# Altium schematic sheet oiler_sch.SchDoc
size A4
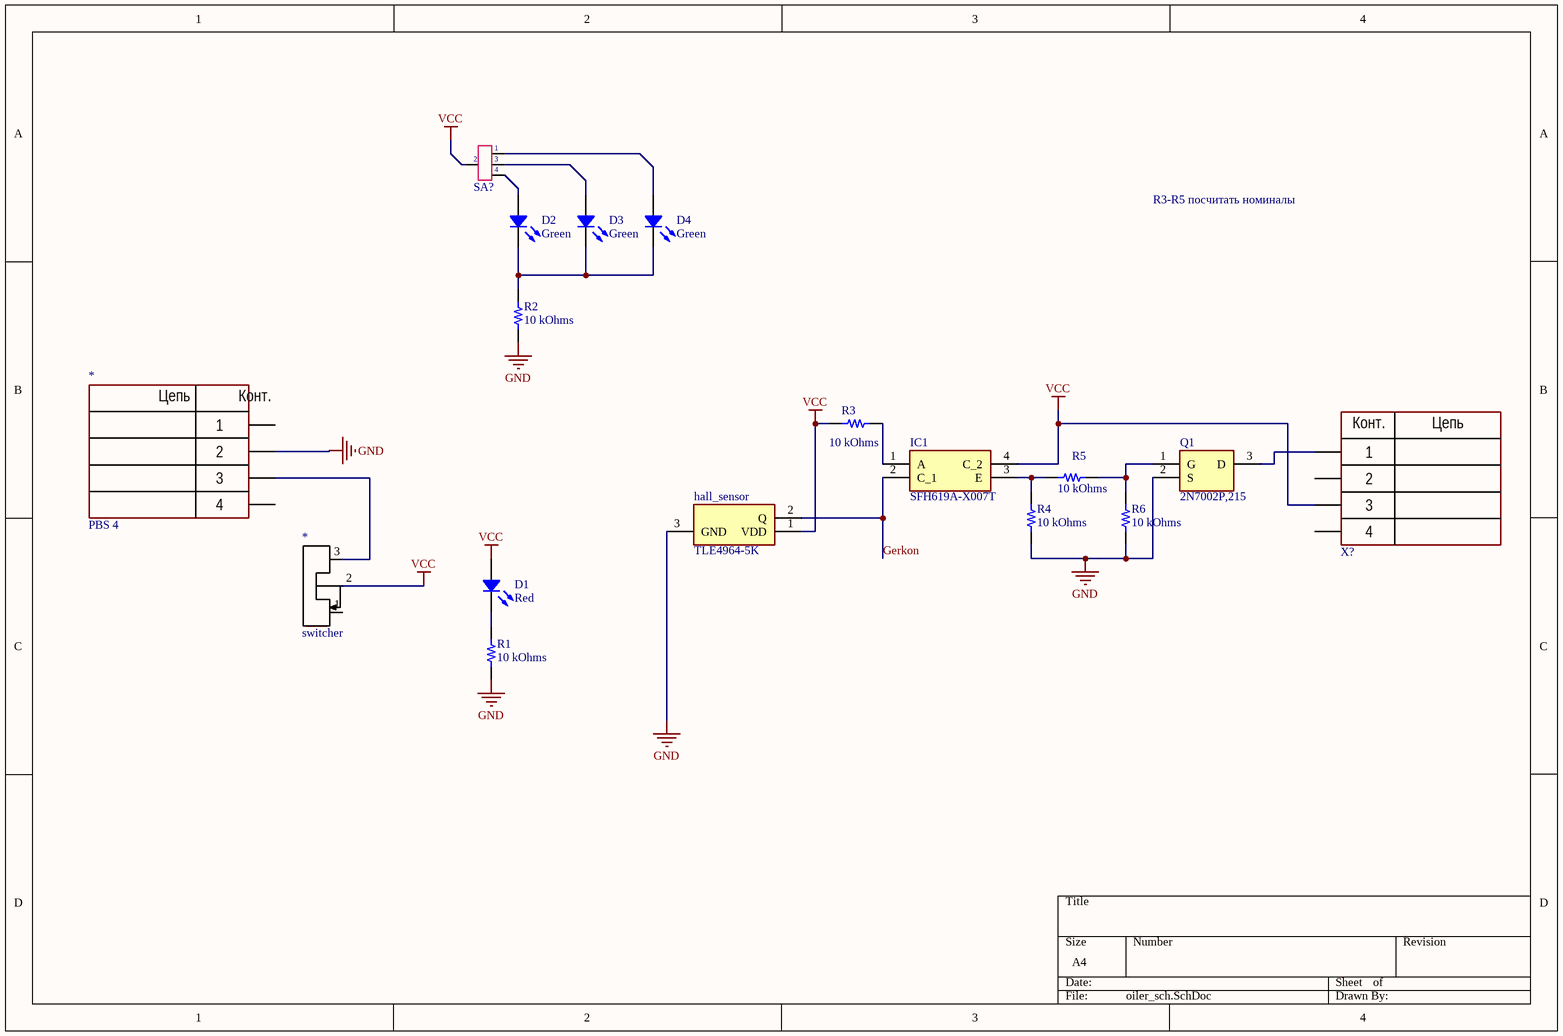
[diagram p0: oiler_sch.SchDoc]

## Parts
(Parts that share a designator on the sheet are numbered #1, #2 ... from top to bottom, then left to right.)
*#1  PBS 4  [PBS-4 CUT]
*#2  switcher  [switcher]
D1  Red  [LED 1206_3216 RED]
D2  Green  [LED 0603_1608 GREEN]
D3  Green  [LED 0603_1608 GREEN]
D4  Green  [LED 0603_1608 GREEN]
hall_sensor  TLE4964-5K  [SOT95P285X120-3N]
IC1  SFH619A-X007T  [SOP252P1016X430-4N]
Q1  2N7002P,215  [SOT95P230X110-3N]
R1  10 kOhms  [RES 0603_1608]
R2  10 kOhms  [RES 0603_1608]
R3  10 kOhms  [RES 0603_1608]
R4  10 kOhms  [RES 0603_1608]
R5  10 kOhms  [RES 0603_1608]
R6  10 kOhms  [RES 0603_1608]
SA?  Switcher  [SMD]  (value not drawn)
X?  PLS 4  [pls-4 right angle]  (value not drawn)

## Nets
GND: *#1.2 hall_sensor.3(GND) Q1.2(S) R1.1 R2.1 R4.2 R6.1
VCC: *#2.2 D1.1 hall_sensor.1(VDD) IC1.4(C_2) R3.2 SA?.2 X?.3
Gerkon: hall_sensor.2(Q) IC1.2(C_1)
Net*#1_3: *#1.3 *#2.3
NetD1_2: D1.2 R1.2
NetD2_1: D2.1 SA?.4
NetD2_2: D2.2 D3.2 D4.2 R2.2
NetD3_1: D3.1 SA?.3
NetD4_1: D4.1 SA?.1
NetIC1_1: IC1.1(A) R3.1
NetIC1_3: IC1.3(E) R4.1 R5.1
NetQ1_1: Q1.1(G) R5.2 R6.2
NetQ1_3: Q1.3(D) X?.1

Not connected (* = marked no-connect by the designer): *#1 1 4; *#2 1; X? 2 4

## Notes on the sheet
- R3-R5 посчитать номиналы
- (in symbol PBS 4) Цепь; Конт.
- (in symbol PLS 4) Конт.; Цепь

## Library data of the parts
D1 = SML-LX1206SIC-TR: LED RED CLEAR 1206 SMD; Manufacturer: Lumex Opto/Components Inc.; Configuration: Standard; Current - Test: 20mA; Lens Color: Colorless; Lens Size: 2.00mm x 1.50mm; Lens Style: Rectangle with Flat Top; Millicandela Rating: 54mcd; Viewing Angle: 130°; Voltage - Forward (Vf) (Typ): 2V; Wavelength - Peak: 632nm; Part Number: SML-LX1206SIC-TR; Color: Red; ComponentLink1Description: Datasheet; ComponentLink1URL: https://www.lumex.com/content/files/ProductAttachment/SML-LX1206SIC-TR.pdf; ComponentLink2Description: DigiKey Link; ComponentLink2URL: http://digikey.com/product-detail/en/lumex-opto-components-inc/SML-LX1206SIC-TR/67-1695-1-ND/467580; Device Package: 1206 (3216 Metric); Height (Max): 1.10mm; LastUpdated: 21.01.2020 3:14:28; Lens Transparency: Clear; Lifecycle Status: Active; Minimum Order: 1; Mounting Type: Surface Mount; Package / Case: 1206 (3216 Metric); Packaging: TapeAndReel; PartId: 205; Part Status: Active; Price: 0.11; Series: -; Size / Dimension: 3.20mm L x 1.60mm W; Supplier 1: DigiKey; Supplier Part Number 1: 67-1695-1-ND; Supplier Device Package: 1206; Value: Red
D2-D4 = LSM0603453V: LED SM 0603 3V -/1000/-MCD GREEN; Manufacturer: Visual Communications Company - VCC; Configuration: Standard; Current - Test: 20mA; Lens Color: Colorless; Lens Size: 1.20mm x 0.80mm; Lens Style: Rectangle with Flat Top; Lens Transparency: Clear; Millicandela Rating: 63mcd; Viewing Angle: 120°; Voltage - Forward (Vf) (Typ): 2V; Wavelength - Dominant: 572nm; Wavelength - Peak: 571nm; Part Number: LSM0603453V; Color: Green; ComponentLink1Description: Datasheet; ComponentLink1URL: https://vcclite.com/wp-content/uploads/wpallimport/files/files/LSM0603453V.pdf; ComponentLink2Description: DigiKey Link; ComponentLink2URL: http://digikey.com/product-detail/en/visual-communications-company-vcc/LSM0603453V/LSM0603453VCT-ND/9486729; Device Package: 0603 (1608 Metric); Height (Max): 0.65mm; LastUpdated: 21.01.2020 3:12:15; Lifecycle Status: Active; Minimum Order: 1; Mounting Type: Surface Mount; Package / Case: 0603 (1608 Metric); Packaging: TapeAndReel; PartId: 579; Part Status: Active; Price: 0.06; Series: LSM0603; Size / Dimension: 1.60mm L x 0.80mm W; Supplier 1: DigiKey; Supplier Part Number 1: LSM0603453VCT-ND; Supplier Device Package: Chip LED; Value: Green
hall_sensor = TLE4964-3K: Switch; Manufacturer_Name: Infineon; Datasheet Link: http://uk.rs-online.com/web/p/products/1107461; Height: 1.2mm; Manufacturer_Part_Number: TLE4964-3K; Mouser Part Number: 726-TLE4964-3K; Mouser Price/Stock: https://www.mouser.com/Search/Refine.aspx?Keyword=726-TLE4964-3K
IC1 = SFH619A-X007T: Integrated Circuit; Manufacturer_Name: Vishay; Datasheet Link: http://www.vishay.com/docs/83674/sfh619a.pdf; Height: 4.3mm; Manufacturer_Part_Number: SFH619A-X007T; Mouser Part Number: 782-SFH619A-X007T; Mouser Price/Stock: https://www.mouser.com/Search/Refine.aspx?Keyword=782-SFH619A-X007T; RS Part Number: 1807876; RS Price/Stock: http://uk.rs-online.com/web/p/products/1807876
Q1 = 2N7002P,215: Transistor; Manufacturer_Name: Nexperia; Datasheet Link: http://www.farnell.com/datasheets/1936237.pdf; Height: 1.1mm; Manufacturer_Part_Number: 2N7002P,215; Mouser Part Number: 771-2N7002P-215; Mouser Price/Stock: https://www.mouser.com/Search/Refine.aspx?Keyword=771-2N7002P-215; RS Part Number: 7920765P; RS Price/Stock: http://uk.rs-online.com/web/p/products/7920765P
R1-R6 = RNCS0603BKE10K0: RES 10K OHM 0.1% 1/16W 0603; Manufacturer: Stackpole Electronics Inc; Power (Watts): 0.063W, 1/16W; Temperature Coefficient: ±25ppm/°C; Part Number: RNCS0603BKE10K0; Value: 10 kOhms; ComponentLink1Description: Datasheet; ComponentLink1URL: https://www.seielect.com/catalog/sei-rncs_rnch.pdf; ComponentLink2Description: DigiKey Link; ComponentLink2URL: http://digikey.com/product-detail/en/stackpole-electronics-inc/RNCS0603BKE10K0/RNCS0603BKE10K0CT-ND/1800113; Composition: Thin Film; Device Package: 0603 (1608 Metric); Features: Anti-Corrosive, Automotive AEC-Q200, Moisture Resistant; Height - Seated (Max): 0.022" (0.55mm); LastUpdated: 21.01.2020 0:25:01; Lifecycle Status: Active; Minimum Order: 1; Number of Terminations: 2; Operating Temperature: -55°C ~ 155°C; Package / Case: 0603 (1608 Metric); Packaging: TapeAndReel; PartId: 4838; Part Status: Active; Price: 0.08; Ratings: AEC-Q200; Resistance: 10 kOhms; Series: RNCS; Size / Dimension: 0.061" L x 0.031" W (1.55mm x 0.80mm); Supplier 1: DigiKey; Supplier Part Number 1: RNCS0603BKE10K0CT-ND; Supplier Device Package: 0603; Tolerance: ±0.1%